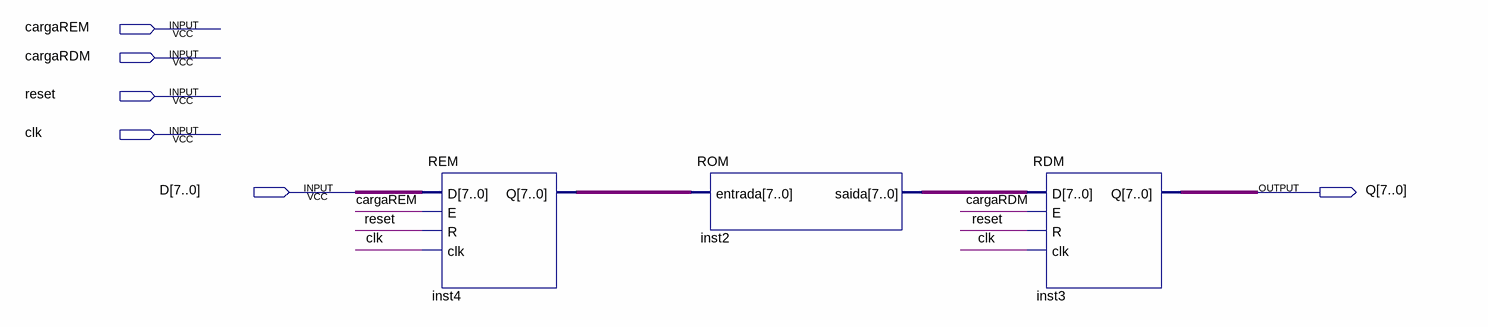
[diagram p0: schematic sheet]
// Quartus schematic Memoria.bdf as structural Verilog: 3 symbols, 6 pins
module Memoria (
  input  cargaREM,
  input  cargaRDM,
  input  reset,
  input  clk,
  input  [7:0] D,
  output [7:0] Q
);

  wire [7:0] inst2_saida, inst4_q;

  REM inst4 (.D(D), .E(cargaREM), .R(reset), .clk(clk), .Q(inst4_q));
  ROM inst2 (.entrada(inst4_q), .saida(inst2_saida));
  RDM inst3 (.D(inst2_saida), .E(cargaRDM), .R(reset), .clk(clk), .Q(Q));
endmodule
